# EAGLE design XBee8 (EAGLE 7.4.0)
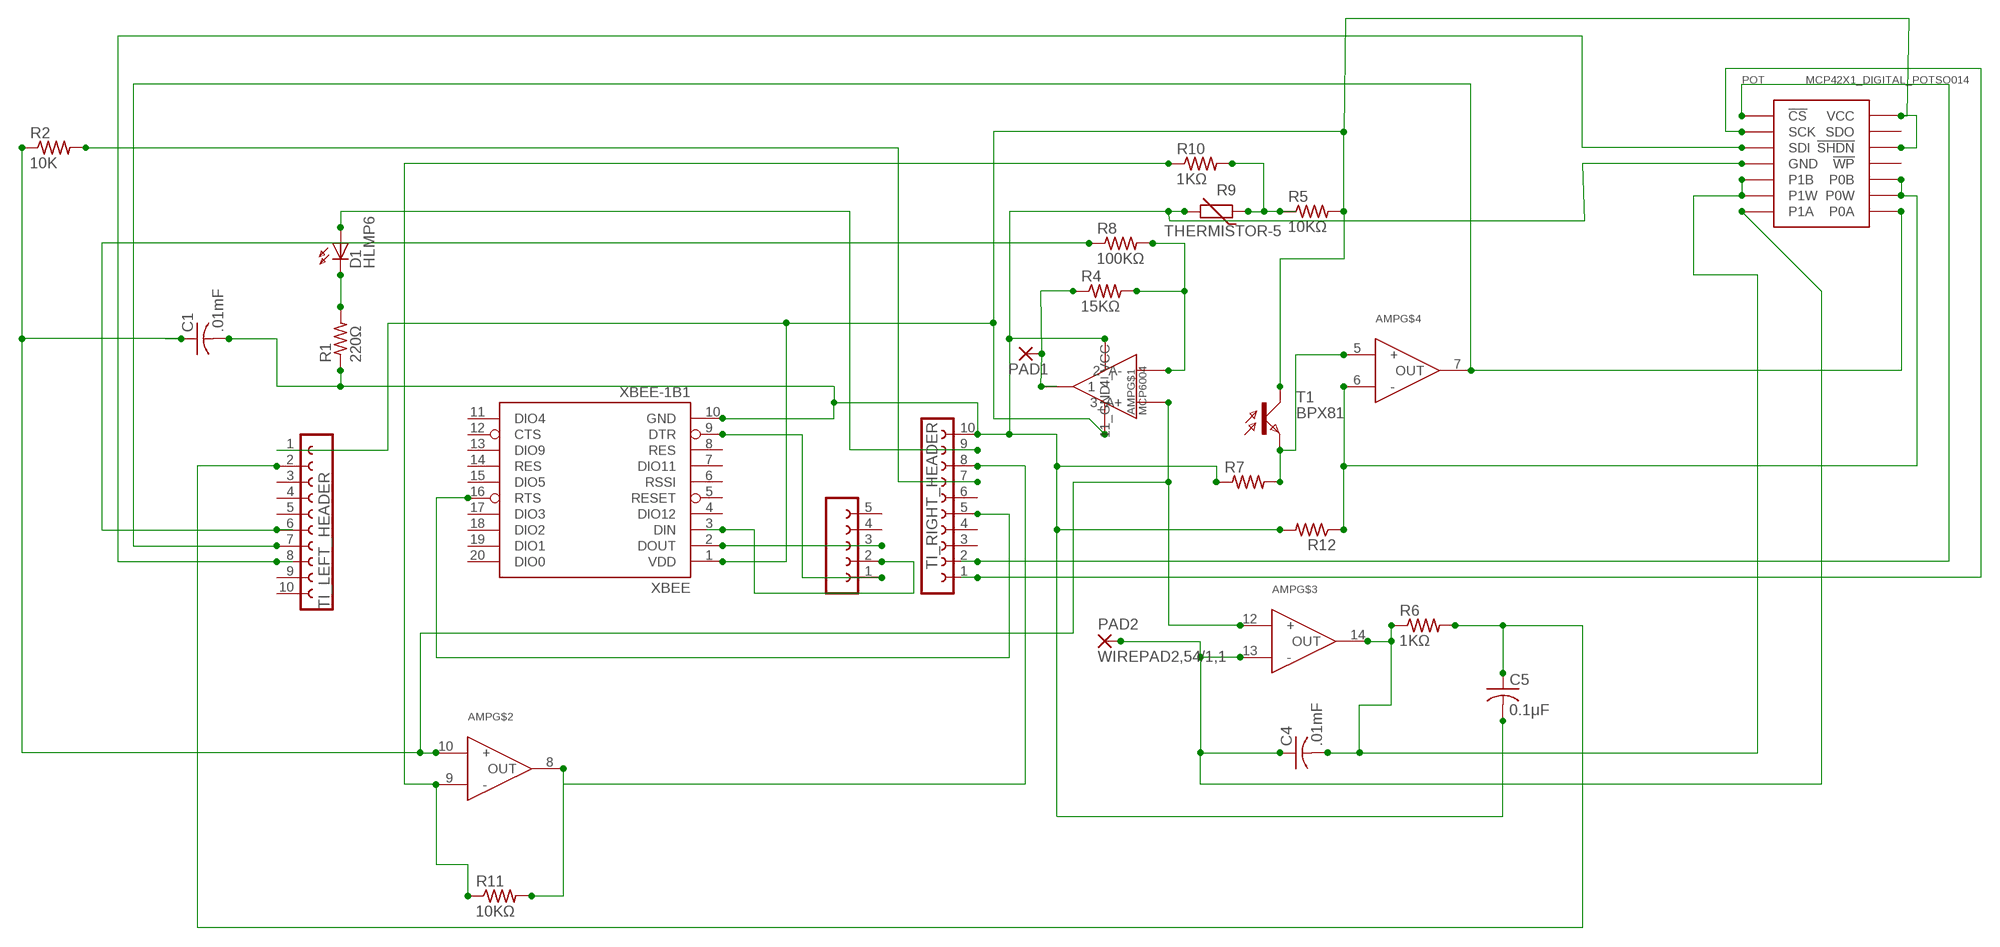
[diagram p0: schematic, sheet 1]

## Parts
AMP  MCP6004  [SO014]
C1  .01mF  C-USC0603  [C0603]
C4  .01mF  C-USC0603  [C0603]
C5  0.1μF  C-USC0603  [C0603]
D1  HLMP6  [HLMP6]
PAD1  WIREPAD2,54/1,1  [2,54/1,1]
PAD2  WIREPAD2,54/1,1  [2,54/1,1]
POT  MCP42X1_DIGITAL_POTSO014  [SO014]
R1  220Ω  R-US_R0603  [R0603]
R2  10K  R-US_R0603  [R0603]
R4  15KΩ  R-US_R0603  [R0603]
R5  10KΩ  R-US_R0603  [R0603]
R6  1KΩ  R-US_R0603  [R0603]
R7  R-US_R0603  [R0603]
R8  100KΩ  R-US_R0603  [R0603]
R9  THERMISTOR-5  [R-5]
R10  1KΩ  R-US_R0603  [R0603]
R11  10KΩ  R-US_R0603  [R0603]
R12  R-US_R0603  [R0603]
T1  BPX81  [BPX81]
TI_LEFT_HEADER  FE10-1  [FE10]
TI_RIGHT_HEADER  FE10-1  [FE10]
XBEE  XBEE-1B1  [XBEE-1]
   FE05-1  [FE05-1]

## Nets
GND: AMP.11(11_GND) C1.2 C5.2 POT.P4(GND) R1.1 R7.1 R9.2 R12.2 TI_RIGHT_HEADER.10 XBEE.10(GND)
N$1: D1.K R1.2
N$2: AMP.5(+) R7.2 T1.E
N$3: XBEE.2(DOUT)  .3
N$4: XBEE.9(DTR)  .1
N$5: XBEE.3(DIN)  .2
N$6: R2.2 TI_RIGHT_HEADER.7
N$7: AMP.6(-) POT.P9(P0W) POT.P10(P0B) R12.1
N$8: AMP.8(OUT) R11.2 TI_RIGHT_HEADER.8
N$13: AMP.9(-) R10.1 R11.1
N$14: AMP.1 PAD1.1(P) R4.1
N$15: D1.A TI_RIGHT_HEADER.9
N$17: AMP.13(-) C4.1 PAD2.1(P) POT.P7(P1A)
N$18: AMP.14(OUT) C4.2 POT.P5(P1B) POT.P6(P1W) R6.1
N$19: C5.1 R6.2 TI_LEFT_HEADER.2
N$20: R5.1 R9.1 R10.2
N$21: AMP.2(2_A-) R4.2 R8.2
N$22: TI_RIGHT_HEADER.5 XBEE.16(RTS)
POT_CS: POT.P1(!CS) TI_RIGHT_HEADER.2
POT_SCK: POT.P2(SCK) TI_RIGHT_HEADER.1
POT_SDI: POT.P3(SDI) TI_LEFT_HEADER.8
PULSE: R8.1 TI_LEFT_HEADER.6
PWM-VCC/2: AMP.3(3_A+) AMP.10(+) AMP.12(+) C1.1 R2.1
TI_PN7_READ: AMP.7(OUT) POT.P8(P0A) TI_LEFT_HEADER.7
VCC: AMP.4(4_VCC) POT.P12(!SHDN) POT.P14(VCC) R5.2 T1.C TI_LEFT_HEADER.1 XBEE.1(VDD)
Unconnected: POT.P11(!WP) POT.P13(SDO) TI_LEFT_HEADER.3 TI_LEFT_HEADER.4 TI_LEFT_HEADER.5 TI_LEFT_HEADER.9 TI_LEFT_HEADER.10 TI_RIGHT_HEADER.3 TI_RIGHT_HEADER.4 TI_RIGHT_HEADER.6 XBEE.4(DIO12) XBEE.5(RESET) XBEE.6(RSSI) XBEE.7(DIO11) XBEE.8(RES) XBEE.11(DIO4) XBEE.12(CTS) XBEE.13(DIO9) XBEE.14(RES) XBEE.15(DIO5) XBEE.17(DIO3) XBEE.18(DIO2) XBEE.19(DIO1) XBEE.20(DIO0)  .4  .5

## Library data of the parts
AMP = SparkFun-AnalogIC:MCP6004: 14SOIC quad op amp, R2R, low power
C1 C4 C5 = rcl:C-US: CAPACITOR, American symbol
D1 = display-hp:HLMP6: LED 2mm horizontal; MF: AGILENT TECHNOLOGIES; MPN: HLMP-6500; OC_FARNELL: 1652490; OC_NEWARK: 40K0088
PAD1 PAD2 = wirepad:WIREPAD: Wire PAD connect wire on PCB
POT = JackLibrary:MCP42X1_DIGITAL_POT
R1 R2 R4-R8 R10-R12 = resistor:R-US_: RESISTOR, American symbol
R9 = varistor:THERMISTOR: THERMISTOR
T1 = opto-trans-siemens:BPX81: PHOTO TRANSISTOR; OC_FARNELL: unknown; OC_NEWARK: unknown
TI_LEFT_HEADER TI_RIGHT_HEADER = con-lsta:FE10-1: FEMALE HEADER; OC_FARNELL: unknown; OC_NEWARK: unknown
XBEE = SparkFun-RF:XBEE-1: Xbee module footprints SMT header is CONN-09042.
  = con-lsta:FE05-1: FEMALE HEADER; OC_FARNELL: unknown; OC_NEWARK: unknown

## Board
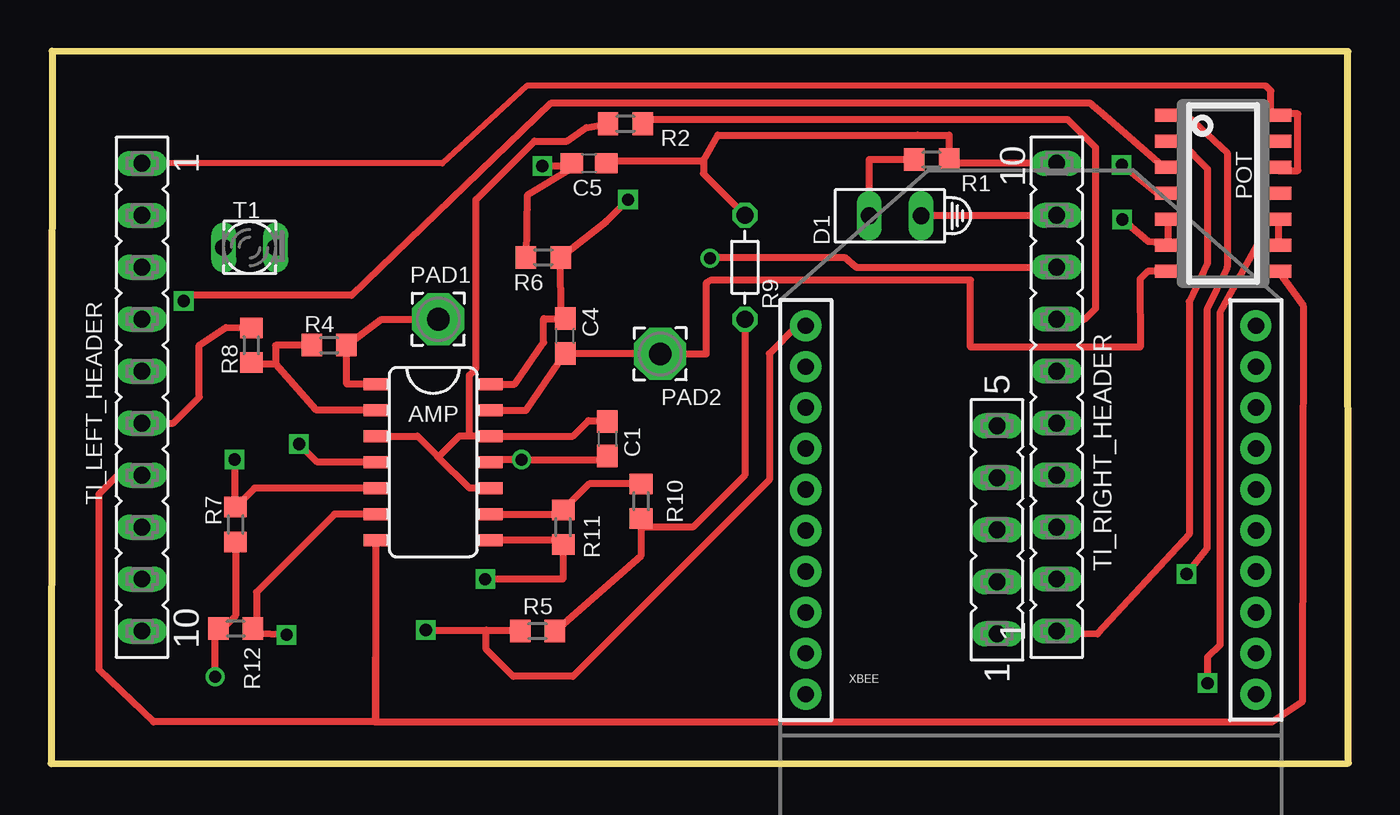
[diagram p1: board, top side]
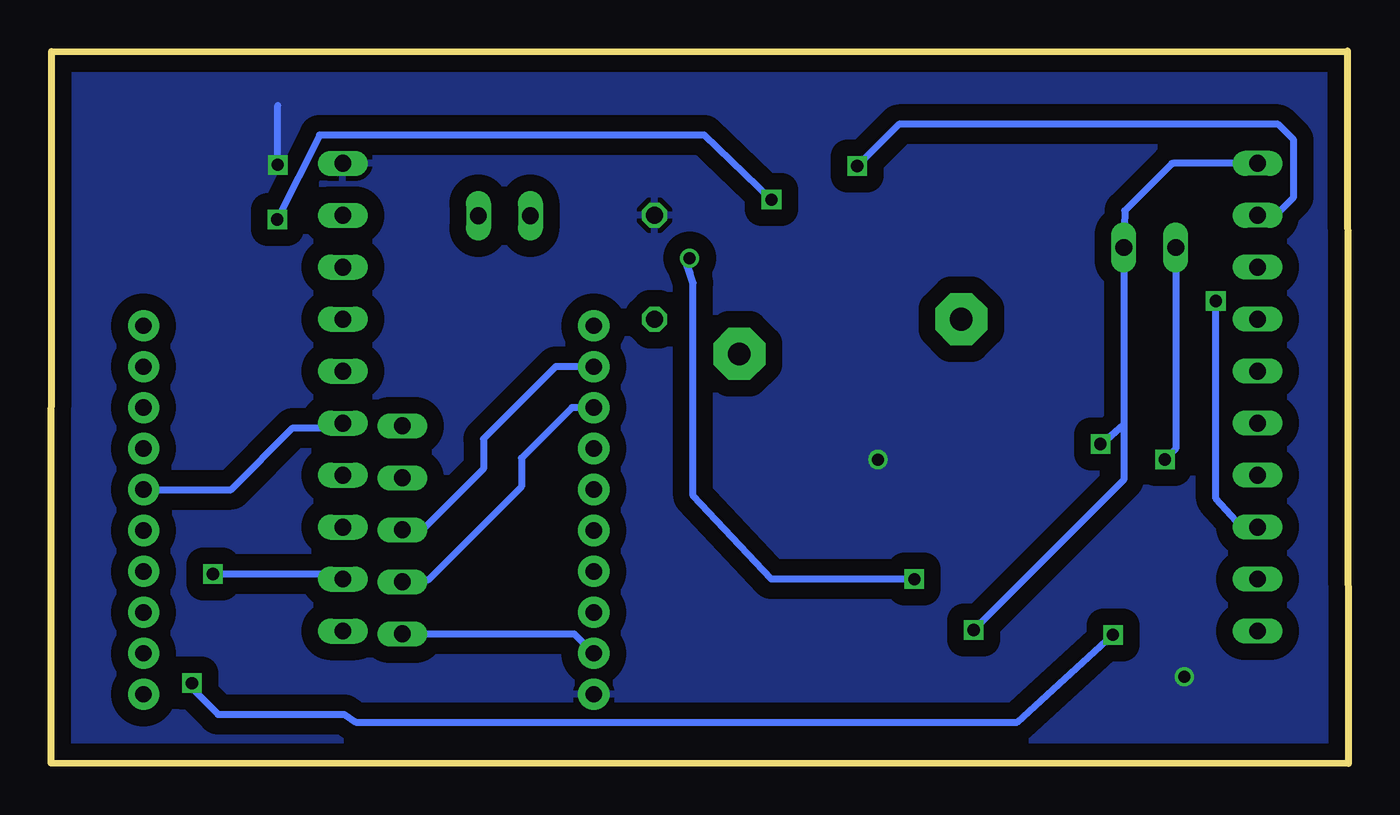
[diagram p2: board, bottom side, seen from below]

Size 63.4 x 34.81 mm. Coordinates in mm from the lower left corner, seen from the top.
Outline: 63.4,0.03 63.37,34.79 0.05,34.81 0,0 63.4,0.03
Copper layers (1*16): Top 0.0356mm / dielectric 1.5011mm / Bottom 0.0356mm
Design rules "OSHPark": minimum track width 6mil, minimum drill 13mil, track to track 6mil, track to pad 6mil, pad to pad 6mil, via to via 6mil, smd to smd 6mil, copper to edge 15mil, drill to drill 6mil, minimum pad ring 7mil, minimum via ring 7mil, stop-mask expansion 3mil, vias tented up to drill 0mil, thermal gap 10mil

### Footprints (pad centres in the part's own frame; a part is rotated, then mirrored left to right if it is on the bottom)
SO014 = smd 0.6 x 1.2: 1 -3.175,-2.8; 2 -1.905,-2.8; 3 -0.635,-2.8; 4 0.635,-2.8; 5 1.905,-2.8; 6 3.175,-2.8; 7 4.445,-2.8; 8 4.445,2.8; 9 3.175,2.8; 10 1.905,2.8; 11 0.635,2.8; 12 -0.635,2.8; 13 -1.905,2.8; 14 -3.175,2.8
C0603 = smd 1.1 x 1: 1 -0.85,0; 2 0.85,0
HLMP6 = drill 0.813 long: A -1.27,0; K 1.27,0
2,54/1,1 = drill 1.118 pad 2.54 octagon: 1 0,0
SO014' = smd 1.27 x 0.635: P1 -2.692,3.81; P2 -2.692,2.54; P3 -2.692,1.27; P4 -2.692,0; P5 -2.692,-1.27; P6 -2.692,-2.54; P7 -2.692,-3.81; P8 2.692,-3.81; P9 2.692,-2.54; P10 2.692,-1.27; P11 2.692,0; P12 2.692,1.27; P13 2.692,2.54; P14 2.692,3.81
R0603 = smd 1 x 1.1: 1 -0.85,0; 2 0.85,0
R-5 = drill 0.813 octagon: 1 -2.54,0; 2 2.54,0
BPX81 = drill 0.813 long: C 1.27,0; E -1.27,0
FE10 = drill 0.813 long: 1 -11.43,0; 2 -8.89,0; 3 -6.35,0; 4 -3.81,0; 5 -1.27,0; 6 1.27,0; 7 3.81,0; 8 6.35,0; 9 8.89,0; 10 11.43,0
XBEE-1 = drill 0.8 pad 1.524: 1 -11,20; 2 -11,18; 3 -11,16; 4 -11,14; 5 -11,12; 6 -11,10; 7 -11,8; 8 -11,6; 9 -11,4; 10 -11,2; 11 11,2; 12 11,4; 13 11,6; 14 11,8; 15 11,10; 16 11,12; 17 11,14; 18 11,16; 19 11,18; 20 11,20
FE05-1 = drill 0.813 long: 1 -5.08,0; 2 -2.54,0; 3 0,0; 4 2.54,0; 5 5.08,0

### Placement (x,y rotation side)
AMP  18.67,15.37 270 top
C1  27.18,15.88 270 top
C4  25.12,20.9 90 top
C5  26.29,29.34 0 top
D1  41.25,26.77 180 top
PAD1  18.92,21.72 0 top
PAD2  29.77,20.02 0 top
POT  MCP42X1_DIGITAL_POTSO014  [SO014']  57.28,27.86 0 top
R1  43.03,29.51 180 top
R2  28.07,31.27 0 top
R4  13.59,20.45 180 top
R5  23.77,6.48 180 top
R6  24.05,24.74 180 top
R7  9.02,11.68 90 top
R8  9.78,20.45 270 top
R9  33.91,24.26 90 top
R10  28.83,12.83 270 top
R11  25.02,11.56 270 top
R12  9.02,6.6 180 top
T1  9.7,25.22 0 top
TI_LEFT_HEADER  4.45,17.91 270 top
TI_RIGHT_HEADER  49.15,17.91 90 top
XBEE  47.88,1.4 0 top
   46.23,11.43 90 top

### Tracks (layer width: path | path; a pad name or v marks a point on that pad's centre or on a via)
GND  (via drill 0.58, 0.6)
  Top 0.33: POT.P4 54.53,27.74 54.23,27.74 v52.32,29.26 | 49.23,29.34 TI_RIGHT_HEADER.10 43.88,29.34 R1.1 43.88,30.71 42.34,30.71 32.59,30.71 31.88,29.46 | 31.88,29.46 27.43,29.46 C5.2 | R9.2 31.88,28.83 31.88,29.46 | AMP.11 21.72,14.86 v22.99,14.86 27.01,14.86 C1.2 | R7.1 9.02,7.24 8.38,6.6 R12.2 8.01,6.45 v8.01,4.25
  Bottom 0.33: v52.32,29.26 52.32,32.16
  pour Bottom (isolate 0.813): 0.61,1.02 0.71,34.16 62.79,33.99 62.79,0.91
N$1
  Top 0.33: R1.2 39.98,29.52 D1.K
N$2  (via drill 0.6)
  Top 0.33: AMP.5 9.95,13.46 R7.2 8.97,12.59 v8.97,14.86
  Bottom 0.33: T1.E 8.43,15.39 v8.97,14.86
N$3
  Bottom 0.33: XBEE.2 38.74,19.4 42.27,15.88 42.27,14.4 45.31,11.35 46.15,11.35  .3
N$4
  Bottom 0.33:  .1 37.83,6.35 XBEE.9
N$5
  Bottom 0.33: XBEE.3 37.95,17.4 40.41,14.93 40.41,13.54 44.98,8.97 46.15,8.97  .2
N$6
  Top 0.33: TI_RIGHT_HEADER.7 50.52,21.72 51.05,22.25 51.05,30.1 49.68,31.47 29.12,31.47 R2.2
N$7  (via drill 0.6)
  Top 0.33: AMP.6 13.84,12.19 10.03,8.38 10.03,6.77 R12.1 9.94,6.35 v11.51,6.3 | POT.P10 POT.P9 58.93,25.32 57.12,22.05 57.12,5.79 56.51,5.21 v56.51,3.94
  Bottom 0.33: v11.51,6.3 16.18,2.03 48.51,2.03 49.07,2.41 55.24,2.41 56.51,3.68 v56.51,3.94
N$8  (via drill 0.58, 0.6)
  Top 0.33: AMP.8 24.9,10.92 R11.2 25.02,9.01 v21.21,9.02 | v32.19,24.7 32.32,24.74 38.77,24.74 39.32,24.26 49.02,24.26 TI_RIGHT_HEADER.8
  Bottom 0.33: v21.21,9.02 28.19,9.01 32.02,13.08 32.02,23.5 32.19,23.94 | 32.19,23.94 32.35,24.44 | v32.19,24.7 32.41,24.59 32.19,23.94
N$13
  Top 0.33: AMP.9 25.03,12.19 R11.1 26.29,13.68 R10.1
N$14
  Top 0.33: AMP.1 14.45,18.54 R4.1 16.13,21.71 PAD1.1
N$15
  Top 0.33: TI_RIGHT_HEADER.9 49.15,26.77 D1.A
N$17
  Top 0.33: AMP.13 23.2,17.27 C4.1 29.78,20.05 PAD2.1 32.02,20.02 32.02,23.5 32.25,23.63 32.72,23.63 44.93,23.63 44.93,20.36 53.23,20.35 53.21,23.67 53.59,24.05 POT.P7
N$18  (via drill 0.6)
  Top 0.33: v28.19,27.56 27.14,26.5 R6.1 24.93,21.79 C4.2 25.14,21.75 24.07,21.75 24.07,20.58 22.66,18.56 | v52.35,26.59 52.63,26.36 53.59,25.53 54.46,25.45 POT.P6 POT.P5 | AMP.14 22.64,18.54 22.66,18.56 | 22.66,18.56
  Bottom 0.33: v28.19,27.56 31.47,30.71 50.28,30.71 v52.35,26.59
N$19  (via drill 0.6)
  Top 0.33: v24,29.21 25.31,29.21 C5.1 25.53,29.15 23.27,27.76 R6.2
  Bottom 0.33: TI_LEFT_HEADER.2 3.56,26.8 2.67,27.69 2.67,30.48 3.43,31.24 21.97,31.24 v24,29.21
N$20
  Top 0.33: R9.1 33.91,14.1 31.37,11.56 28.96,11.56 R10.2 28.83,10.16 R5.1
N$21
  Top 0.33: AMP.2 12.95,17.27 10.98,19.53 | 10.98,19.53 9.94,19.53 R8.2 | R4.2 10.97,20.44 10.98,19.53
N$22
  Bottom 0.33: XBEE.16 54.6,13.4 51.59,16.41 49.38,16.41 TI_RIGHT_HEADER.5
POT_CS  (via drill 0.6)
  Top 0.33: POT.P1 55.5,31.67 57.48,29.85 57.48,24.26 56.49,22.2 56.49,10.52 v55.5,9.27
  Bottom 0.33: v55.5,9.27 49.4,9.27 TI_RIGHT_HEADER.2
POT_SCK
  Top 0.33: POT.P2 55.18,30.4 56.51,29.07 56.51,24.45 55.63,22.58 55.63,11.2 51.13,6.34 49.12,6.34 TI_RIGHT_HEADER.1
POT_SDI  (via drill 0.6)
  Top 0.33: POT.P3 54.28,29.21 51.51,31.62 50.75,32.28 24.44,32.28 14.68,22.88 6.76,22.88 v6.48,22.61
  Bottom 0.33: TI_LEFT_HEADER.8 5.21,11.56 6.48,12.95 v6.48,22.61
PULSE
  Top 0.33: TI_LEFT_HEADER.6 5.97,16.64 7.24,17.91 7.24,20.45 8.54,21.31 9.72,21.32 R8.1
PWM-VCC/2
  Top 0.33: AMP.10 20.45,13.46 18.92,14.99 | 18.92,14.99 18.8,15.11 18.54,15.37 17.91,16 AMP.3 | 20.45,16 AMP.12 25.5,16 26.26,16.76 27.14,16.76 C1.1 | 20.45,16 19.94,16 18.92,14.99 | 20.45,16 20.45,18.99 20.76,19.3 20.76,27.56 23.62,30.42 25.21,30.42 26.15,31.08 R2.1
TI_PN7_READ
  Top 0.33: AMP.7 15.87,5.23 | 15.87,5.23 15.87,2.19 15.83,2.04 5.01,2.04 2.34,4.6 2.34,13.18 3.38,14.22 4.32,14.22 TI_LEFT_HEADER.7 | POT.P8 61.19,22.38 61.14,3.02 59.66,2.04 15.85,2.04 15.87,5.23
VCC  (via drill 0.6)
  Top 0.305: 59.36,33.12 23.24,33.12 19.11,29.33 4.5,29.33 TI_LEFT_HEADER.1
  Top 0.33: v18.31,6.53 21.26,6.53 | 21.26,6.53 22.87,6.53 R5.2 | AMP.4 13,14.73 v12.12,15.62 | POT.P14 59.61,31.75 | 60.6,28.98 59.97,28.98 POT.P12 60.22,28.98 60.6,28.98 | XBEE.1 36.46,21.4 35.1,20.04 35.1,13.87 25.5,4.27 22.58,4.27 21.26,5.59 21.26,6.53 | 60.6,28.98 60.94,28.97 60.94,31.75 59.61,31.75 | 59.61,31.75 59.61,32.87 59.36,33.12
  Bottom 0.33: 10.97,16.56 T1.C 10.96,25.43 10.93,27.02 8.63,29.32 8.56,29.34 TI_LEFT_HEADER.1 | 10.97,16.56 10.97,13.87 v18.31,6.53 | v12.12,15.62 11.98,15.68 10.97,16.56